# Altium project Signal_Processing_Board_Manta.PrjPcb (part 1 of 2)
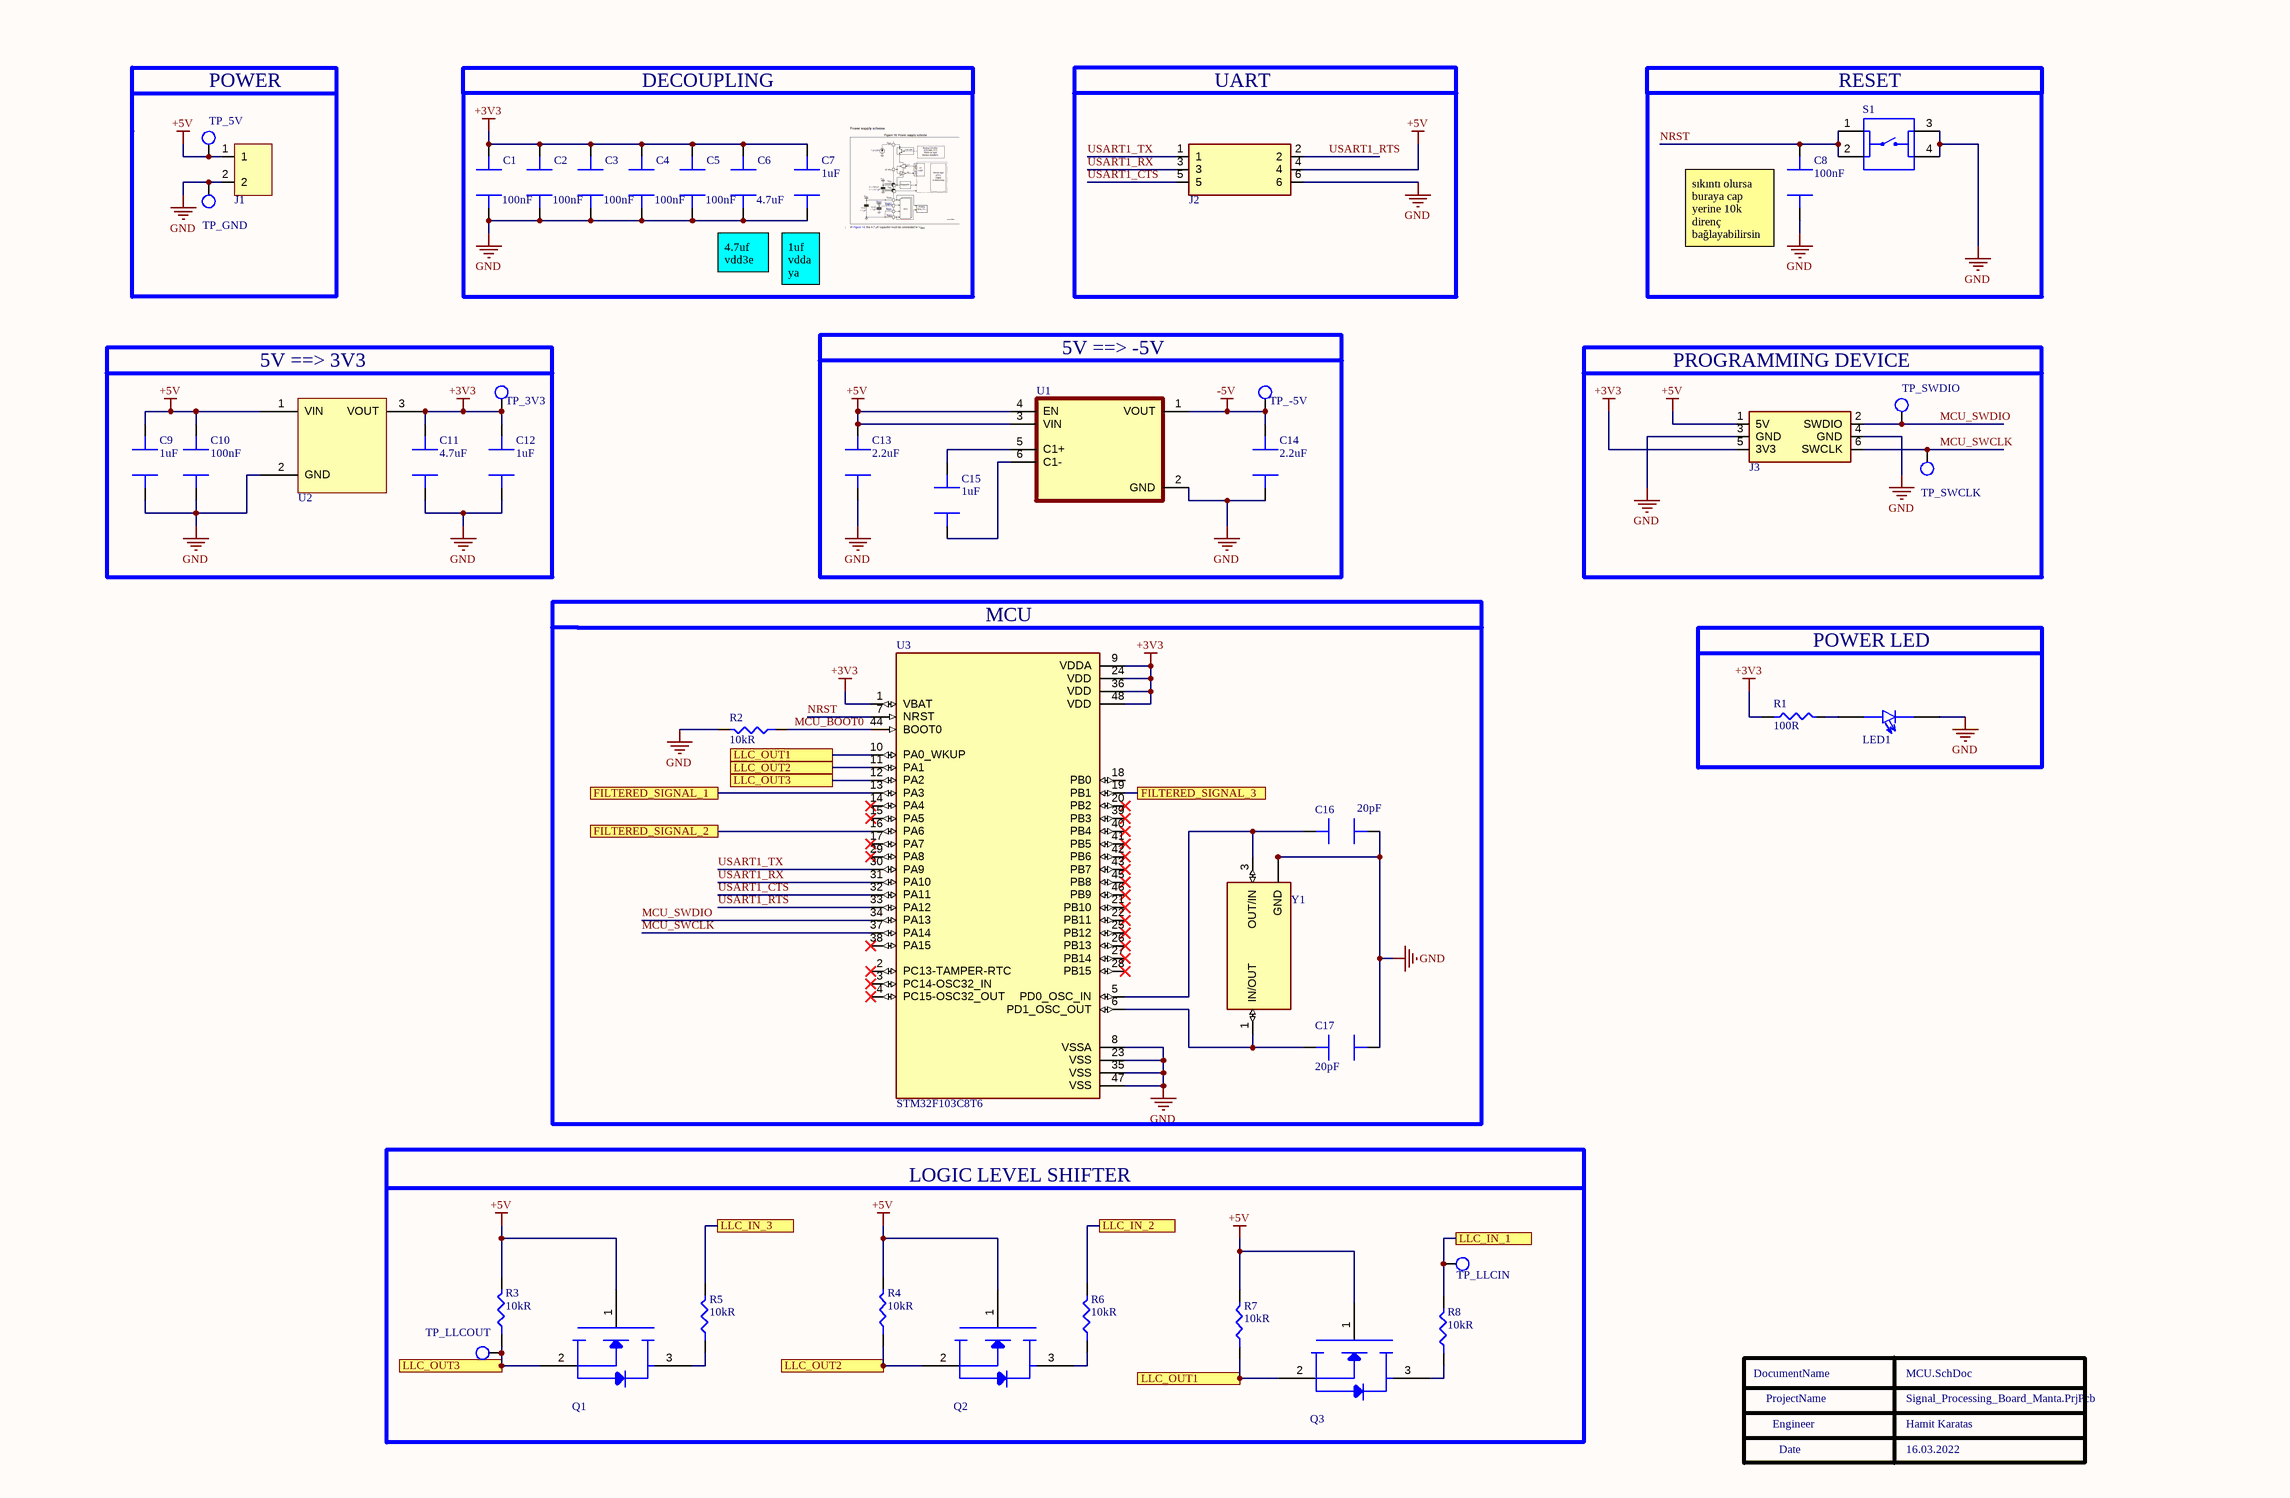
[diagram p0: MCU.SchDoc]
2 sheets, 122 parts. Net scope: flat (ports and power ports of the same name join across sheets).
Board file: MantaFilter.PcbDoc
Sheets:
  MCU.SchDoc
  FILTER.SchDoc

## Sheet MCU.SchDoc
size 420 x 297 mm; Engineer: Hamit Karatas; SheetNumber: 1; SheetTotal: 2

### Parts
C1  Capacitance: 100nF  [CAP_0603]  (hidden comment: CAP CER 100nF 0603)
C2  Capacitance: 100nF  [CAP_0603]  (hidden comment: CAP CER 100nF 0603)
C3  Capacitance: 100nF  [CAP_0603]  (hidden comment: CAP CER 100nF 0603)
C4  Capacitance: 100nF  [CAP_0603]  (hidden comment: CAP CER 100nF 0603)
C5  Capacitance: 100nF  [CAP_0603]  (hidden comment: CAP CER 100nF 0603)
C6  Capacitance: 4.7uF  [cap_0805]  (hidden comment: CL21A475KAQNNNE)
C7  Capacitance: 1uF  [cap_0805]  (hidden comment: CAP CER 1uF 0805)
C8  Capacitance: 100nF  [CAP_0603]  (hidden comment: CAP CER 100nF 0603)
C9  Capacitance: 1uF  [cap_0805]  (hidden comment: CAP CER 1uF 0805)
C10  Capacitance: 100nF  [cap_0805]  (hidden comment: CL21B104KBCNNNC)
C11  Capacitance: 4.7uF  [cap_0805]  (hidden comment: CL21A475KAQNNNE)
C12  Capacitance: 1uF  [cap_0805]  (hidden comment: CAP CER 1uF 0805)
C13  Capacitance: 2.2uF  [CAP_1206]  (hidden comment: CAP CER 2.2uF)
C14  Capacitance: 2.2uF  [CAP_1206]  (hidden comment: CAP CER 2.2uF)
C15  Capacitance: 1uF  [cap_0805]  (hidden comment: CAP CER 1uF 0805)
C16  Capacitance: 20pF  [CAP_0603]  (hidden comment: CL10C200JB8NNNC)
C17  Capacitance: 20pF  [CAP_0603]  (hidden comment: CL10C200JB8NNNC)
J1  TERMINAL BLOCK, PLUGGABLE, 5.08,  [TBP01R1-508-02BE]  (value not drawn)
J2  67997-206HLF  [CONN 6 PINS 2 ROWS]  (value not drawn)
J3  67997-206HLF  [CONN 6 PINS 2 ROWS]  (value not drawn)
LED1  LTST-C171GKT  [LED GREEN 0805]  (value not drawn)
Q1  MOSFET 2N7002W  [SOT-323]  (value not drawn)
Q2  MOSFET 2N7002W  [SOT-323]  (value not drawn)
Q3  MOSFET 2N7002W  [SOT-323]  (value not drawn)
R1  Resistance: 100R  [RES_0603]  (hidden comment: RC0603FR-7W100RL)
R2  Resistance: 10kR  [RES_0603]  (hidden comment: RES 10K OHM 0603)
R3  Resistance: 10kR  [RES_0603]  (hidden comment: RES 10K OHM 0603)
R4  Resistance: 10kR  [RES_0603]  (hidden comment: RES 10K OHM 0603)
R5  Resistance: 10kR  [RES_0603]  (hidden comment: RES 10K OHM 0603)
R6  Resistance: 10kR  [RES_0603]  (hidden comment: RES 10K OHM 0603)
R7  Resistance: 10kR  [RES_0603]  (hidden comment: RES 10K OHM 0603)
R8  Resistance: 10kR  [RES_0603]  (hidden comment: RES 10K OHM 0603)
S1  1825910-6  [button]  (value not drawn)
TP_3V3  TEST_POINT  [TEST POINT]  (value not drawn)  (no BOM)
TP_5V  TEST_POINT  [TEST POINT]  (value not drawn)  (no BOM)
TP_-5V  TEST_POINT  [TEST POINT]  (value not drawn)  (no BOM)
TP_GND  TEST_POINT  [TEST POINT]  (value not drawn)  (no BOM)
TP_LLCIN  TEST_POINT  [TEST POINT]  (value not drawn)  (no BOM)
TP_LLCOUT  TEST_POINT  [TEST POINT]  (value not drawn)  (no BOM)
TP_SWCLK  TEST_POINT  [TEST POINT]  (value not drawn)  (no BOM)
TP_SWDIO  TEST_POINT  [TEST POINT]  (value not drawn)  (no BOM)
U1  Voltage Regulator (5V -> -5V) LM2776DBVT  [SOT23-6]  (value not drawn)
U2  AP7361-33E-13  [AP7361-33E-13]  (value not drawn)
U3  STM32F103C8T6  [LQFP-48]
Y1  CRYSTAL 8MHZ  [CRYSTAL 8MHZ]  (value not drawn)

### Blocks framed on the sheet
POWER: J1 TP_5V TP_GND
DECOUPLING: C1-C7
UART: J2
RESET: C8 S1
5V ==> 3V3: C9-C12 TP_3V3 U2
PROGRAMMING DEVICE: J3 TP_SWCLK TP_SWDIO
POWER LED: LED1 R1
LOGIC LEVEL SHIFTER: Q1-Q3 R3-R8 TP_LLCIN TP_LLCOUT

### Ports
FILTERED_SIGNAL_1, FILTERED_SIGNAL_2, FILTERED_SIGNAL_3, LLC_IN_1, LLC_IN_2, LLC_IN_3, LLC_OUT1, LLC_OUT2, LLC_OUT3

### Nets
+3V3: C1.2 C2.2 C3.2 C4.2 C5.2 C6.2 C7.2 C11.2 C12.2 J3.5(3V3) R1.2 TP_3V3.1(TP) U2.3(VOUT) U3.1(VBAT) U3.9(VDDA) U3.24(VDD) U3.36(VDD) U3.48(VDD)
+5V: C9.2 C10.2 C13.2 J1.1 J2.4 J3.1(5V) Q1.1(G) Q2.1(G) Q3.1(G) R3.2 R4.2 R7.2 TP_5V.1(TP) U1.3(VIN) U1.4(EN) U2.1(VIN)
-5V: C14.2 TP_-5V.1(TP) U1.1(VOUT)
GND: C1.1 C2.1 C3.1 C4.1 C5.1 C6.1 C7.1 C8.1 C9.1 C10.1 C11.1 C12.1 C13.1 C14.1 C16.1 C17.1 J1.2 J2.6 J3.3(GND) J3.4(GND) LED1.C R2.2 S1.3 S1.4 TP_GND.1(TP) U1.2(GND) U2.2(GND) U3.8(VSSA) U3.23(VSS) U3.35(VSS) U3.47(VSS) Y1.2(GND) Y1.4(GND)
MCU_BOOT0: R2.1 U3.44(BOOT0)
MCU_SWCLK: J3.6(SWCLK) TP_SWCLK.1(TP) U3.37(PA14)
MCU_SWDIO: J3.2(SWDIO) TP_SWDIO.1(TP) U3.34(PA13)
NRST: C8.2 S1.1 S1.2 U3.7(NRST)
USART1_CTS: J2.5 U3.32(PA11)
USART1_RTS: J2.2 U3.33(PA12)
USART1_RX: J2.3 U3.31(PA10)
USART1_TX: J2.1 U3.30(PA9)
NetC15_1: C15.1 U1.6(C1-)
NetC15_2: C15.2 U1.5(C1+)
NetC16_2: C16.2 U3.5(PD0_OSC_IN) Y1.3(OUT/IN)
NetC17_2: C17.2 U3.6(PD1_OSC_OUT) Y1.1(IN/OUT)
NetLED1_A: LED1.A R1.1
NetQ1_2: Q1.2(S) R3.1 TP_LLCOUT.1(TP) U3.12(PA2) ; port LLC_OUT3
NetQ1_3: Q1.3(D) R5.1
NetQ2_2: Q2.2(S) R4.1 U3.11(PA1) ; port LLC_OUT2
NetQ2_3: Q2.3(D) R6.1
NetQ3_2: Q3.2(S) R7.1 U3.10(PA0_WKUP) ; port LLC_OUT1
NetQ3_3: Q3.3(D) R8.1
NetR5_2: R5.2 ; port LLC_IN_3
NetR6_2: R6.2 ; port LLC_IN_2
NetR8_2: R8.2 TP_LLCIN.1(TP) ; port LLC_IN_1
NetR10_2: U3.13(PA3) ; port FILTERED_SIGNAL_1
NetR26_2: U3.16(PA6) ; port FILTERED_SIGNAL_2
NetR42_2: U3.19(PB1) ; port FILTERED_SIGNAL_3

Not connected (* = marked no-connect by the designer): U3 2(PC13-TAMPER-RTC)* 3(PC14-OSC32_IN)* 4(PC15-OSC32_OUT)* 14(PA4)* 15(PA5)* 17(PA7)* 18(PB0) 20(PB2)* 21(PB10)* 22(PB11)* 25(PB12)* 26(PB13)* 27(PB14)* 28(PB15)* 29(PA8)* 38(PA15)* 39(PB3)* 40(PB4)* 41(PB5)* 42(PB6)* 43(PB7)* 45(PB8)* 46(PB9)*

### Notes on the sheet
- (near C8) sıkıntı olursa buraya cap yerine 10k direnç bağlayabilirsin
- 4.7uf vdd3e
- (near C7) 1uf vdda ya
- power supply scheme
- 5V ==> -5V
- (near U3) MCU
- 1/4ts male (6.23mm)lik  girişten gelen sinyal filtrelere aktarılıyor. her entegrede 2 opamp var ama her 3 opamp için 2 entegre kullanılacak (2*3=6). Sinyaller hem logic level shifterdan hem de filtrelerden adclere gidecek. Dijitale dönüştürülüp jetsona yollanacak veya burada fast fourier transform yapılıp kontrol kartına motor komutu gönderecek.
- DocumentName
- Çıkışlar mikrodenetleyicinin adc'sine bağlanacak. Bu yüzden çıkışların 2.4V-3.3V aralığında olması gerekiyor. Ltspice'da 5v verince 3v3'e yakın bir değer elde edildiği için 5v bağlandı. sorun olması durumunda 3v3 bağlantısı yapılmalı
- ProjectName
- Engineer
- Date
- 16.03.2022
- THIS DOCUMENT AND THE DATA DISCLOSED HEREIN OR
- HEREWITH IS THE PROPERTY OF ALTIUM LIMITED AND MAY
- DWG NO:
- REVISION
- REV:
- DESCRIPTION
- DATE
- APPROVED
- BE FREELY DISTRIBUTED IN WHOLE. NO RIGHTS ARE
- RESERVED OR EXPRESS OR IMPLIED WARANTEE GIVEN.
- ENG:
- APPROVALS
- PROJECT
- DSN:
- CHK:
- REFERENCE DOCUMENTS
- PROJECT REVISION:
- TITLE
- DOCUMENT REVISION:
- DESIGN ITEM:
- BOM:
- FAB DWG:
- PCB DWG:
- ASSY DWG:
- SCALE:
- A3
- SIZE
- CAGE CODE
- FILE NAME
- DWG NO.
- SHEET
- OF
- REV
- 31.01.2022
- 31.01.2000

### Library data of the parts
C1-C5 C8 = CAP CER 100nF 0603: KEMET - C0603C104K5RACTU - SMD Multilayer Ceramic Capacitor, 0.1 µF, 50 V, 0603 [1608 Metric], ± 10%, X7R, C Series KEMET; Designed by: Hamit; Voltage Rating (DC): 50V; Dissipation Factor: 2.5%; Supplier 1: Digi-Key; Manufacturer: KEMET; Manufacturer Part Number: C0603C104K5RACTU; RoHS: Yes; Category: Ceramic Capacitors; Stock 1: 4486940; Pricing 1: 1=0,12000, 10=0,08900, 50=0,04840, 100=0,03940, 500=0,02818, 1000=0,02214 (USD); Mount: Surface Mount; Case/Package: 0603; Number of Pins: 2; Case Code (Metric): 1608; Case Code (Imperial): 0603; Dielectric Material: Ceramic; Contact Plating: Tin,Matte; Min Operating Temperature: -55°C; Max Operating Temperature: 125°C; Tolerance: 10%; Packaging: Tape and Reel; Package Quantity: 1; Dielectric: X7R; Termination: SMD/SMT; Voltage: 50V; Voltage Rating: 50V; Series: SMD Comm X7R; Length: 0.063inch; Width: 0.031inch; Height: 0.8mm; Thickness: 0.034inch; Lead Pitch: 0.7mm; Depth: 0.8mm; Radiation Hardening: No; RoHS Compliant: Yes; REACH SVHC: No SVHC; ComponentLink1URL: https://datasheet.ciiva.com/7823/kem-c1002-x7r-smd-7823591.pdf?src-supplier=Element14; ComponentLink1Description: https://datasheet.ciiva.com/7823/kem-c1002-x7r-smd-7823591.pdf?src-supplier=Element14; ComponentLink2URL: https://datasheet.ciiva.com/14602/70095383-14602583.pdf?src-supplier=Allied+Electronics; ComponentLink2Description: https://datasheet.ciiva.com/14602/70095383-14602583.pdf?src-supplier=Allied+Electronics; ComponentLink3URL: https://datasheet.ciiva.com/5999/kem-c1002-x7r-smd-5999400.pdf?src-supplier=Farnell; ComponentLink3Description: https://datasheet.ciiva.com/5999/kem-c1002-x7r-smd-5999400.pdf?src-supplier=Farnell; ComponentLink4URL: https://datasheet.ciiva.com/7823/kem-c1002-x7r-smd-7823592.pdf?src-supplier=Element14; ComponentLink4Description: https://datasheet.ciiva.com/7823/kem-c1002-x7r-smd-7823592.pdf?src-supplier=Element14; ComponentLink5URL: https://datasheet.ciiva.com/28645/1851736-28645640.pdf?src-supplier=Element14; ComponentLink5Description: https://datasheet.ciiva.com/28645/1851736-28645640.pdf?src-supplier=Element14; ComponentLink6URL: https://datasheet.ciiva.com/14585/70095383-14585209.pdf?src-supplier=Allied+Electronics; ComponentLink6Description: https://datasheet.ciiva.com/14585/70095383-14585209.pdf?src-supplier=Allied+Electronics; Supplier Part Number 1: 399-5089-6-ND
C6 = CAP CER 4.7 uF: SAMSUNG ELECTRO-MECHANICS - CL21A475KAQNNNE - SMD Multilayer Ceramic Capacitor, 4.7 µF, 25 V, 0805 [2012 Metric], ± 10%, X5R, CL Series; Voltage Rating: 25V; Designed by: Hamit; Supplier 1: Digi-Key; Manufacturer: Samsung; Manufacturer Part Number: CL21A475KAQNNNE; RoHS: Yes; Category: Ceramic Capacitors; Pricing 1: 1=0,12000, 10=0,08300, 50=0,04700, 100=0,03890, 500=0,02728, 1000=0,02259 (USD); Mount: Surface Mount; Case/Package: 0805; Case Code (Metric): 2012; Case Code (Imperial): 0805; Min Operating Temperature: -55°C; Max Operating Temperature: 85°C; Package Quantity: 1; Packaging: Tape and Reel; Tolerance: 10%; Dielectric: X5R; Voltage Rating (DC): 25V; Series: CL; Construction: Flat; Length: 2mm; Width: 0.049inch; Height: 1.25mm; Thickness: 0.055inch; Depth: 1.25mm; Radiation Hardening: No; Lead Free: Lead Free; RoHS Compliant: Yes; ComponentLink1URL: https://datasheet.ciiva.com/25798/cl21a475kaqnnne-25798882.pdf?src-supplier=Digi-Key; ComponentLink1Description: https://datasheet.ciiva.com/25798/cl21a475kaqnnne-25798882.pdf?src-supplier=Digi-Key; Supplier Part Number 1: 1276-1244-1-ND
C7 C9 C12 C15 = CAP CER 1uF 0805: 0805 0.1 uF ±10 % Tolerance 50 V X7R Multilayer Ceramic Capacitors; Manufacturer: Samsung; Manufacturer Part Number: CL21B104KBFNNNE; Designed by: Hamit; Tolerance: 10%; Voltage Rating: 50V; Supplier 1: Digi-Key; RoHS: Yes; Category: Ceramic Capacitors; Pricing 1: 1=0,10000, 10=0,04900, 50=0,02700, 100=0,02200, 500=0,01574, 1000=0,01237 (USD); Mount: Surface Mount; Case/Package: 0805; Case Code (Metric): 2012; Case Code (Imperial): 0805; Contact Plating: Tin; Min Operating Temperature: -55°C; Max Operating Temperature: 125°C; Dielectric: X7R; Package Quantity: 1; Packaging: Tape and Reel; Voltage Rating (DC): 50V; Series: CL; Construction: Flat; Length: 2mm; Width: 0.049inch; Height: 1.25mm; Thickness: 0.053inch; Depth: 1.25mm; Radiation Hardening: No; Lead Free: Lead Free; RoHS Compliant: Yes; ComponentLink1URL: https://datasheet.ciiva.com/25736/cl21b104kbfnnne-25736721.pdf?src-supplier=Digi-Key; ComponentLink1Description: https://datasheet.ciiva.com/25736/cl21b104kbfnnne-25736721.pdf?src-supplier=Digi-Key; Supplier Part Number 1: 1276-1180-1-ND
C10 = CAP cer 100nF 0805: Samsung Electro-Mechanics 100nF Multilayer Ceramic Capacitor (MLCC) 50 V 10% X7R dielectric CL max op. temp. +125C; Designed by: Hamit; Voltage Rating: 50V; Supplier 1: Digi-Key; Manufacturer: Samsung; Manufacturer Part Number: CL21B104KBCNNNC; RoHS: Yes; Category: Ceramic Capacitors; Pricing 1: 1=0,10000, 10=0,05000, 50=0,02740, 100=0,02240, 500=0,01598, 1000=0,01256 (USD); Mount: Surface Mount; Case/Package: 0805; Case Code (Metric): 2012; Case Code (Imperial): 0805; Material: Ceramic; Contact Plating: Tin; Min Operating Temperature: -55°C; Max Operating Temperature: 125°C; Tolerance: 10%; Dielectric: X7R; Packaging: Tape and Reel; Voltage: 50V; Voltage Rating (DC): 50V; Series: CL; Construction: Flat; Length: 2mm; Width: 0.049inch; Height: 0.85mm; Depth: 1.25mm; Thickness: 0.037inch; Radiation Hardening: No; Lead Free: Lead Free; RoHS Compliant: Yes; ComponentLink1URL: https://datasheet.ciiva.com/25710/cl21b104kbcnnnc-25710182.pdf?src-supplier=Digi-Key; ComponentLink1Description: https://datasheet.ciiva.com/25710/cl21b104kbcnnnc-25710182.pdf?src-supplier=Digi-Key; ComponentLink2URL: https://datasheet.ciiva.com/29199/454152-da-01-en-vs-kondensator-0805-29199814.pdf?src-supplier=Conrad; ComponentLink2Description: https://datasheet.ciiva.com/29199/454152-da-01-en-vs-kondensator-0805-29199814.pdf?src-supplier=Conrad; Supplier Part Number 1: 1276-1003-1-ND
C11 = CAP_0805_4.7uF: SAMSUNG ELECTRO-MECHANICS - CL21A475KAQNNNE - SMD Multilayer Ceramic Capacitor, 4.7 µF, 25 V, 0805 [2012 Metric], ± 10%, X5R, CL Series; Voltage Rating: 25V; Designed by: Hamit; Supplier 1: Mouser; Manufacturer: Samsung; Manufacturer Part Number: CL21A475KAQNNNE; RoHS: Yes; Category: Ceramic Capacitors; Stock 1: 975; Pricing 1: 1=0,12000, 10=0,04800, 50=0,04800, 100=0,03900, 500=0,02800, 1000=0,02300, 2000=0,02000, 10000=0,02000 (USD); Mount: Surface Mount; Case/Package: 0805; Case Code (Metric): 2012; Case Code (Imperial): 0805; Min Operating Temperature: -55°C; Max Operating Temperature: 85°C; Package Quantity: 1; Packaging: Tape and Reel; Tolerance: 10%; Dielectric: X5R; Voltage Rating (DC): 25V; Series: CL; Construction: Flat; Length: 2mm; Width: 0.049inch; Height: 1.25mm; Thickness: 0.055inch; Depth: 1.25mm; Radiation Hardening: No; Lead Free: Lead Free; RoHS Compliant: Yes; ComponentLink1URL: https://datasheet.ciiva.com/25798/cl21a475kaqnnne-25798882.pdf?src-supplier=Digi-Key; ComponentLink1Description: https://datasheet.ciiva.com/25798/cl21a475kaqnnne-25798882.pdf?src-supplier=Digi-Key; Supplier Part Number 1: 187-CL21A475KAQNNNE
C13 C14 = CAP CER 2.2uF: Cap Ceramic 2.2uF 16V X7R 10% SMD 1206 125°C Plastic T/R; Manufacturer: KEMET; Manufacturer Part Number: C1206C225K4RACTU; Dissipation Factor: 5%; Supplier 1: Digi-Key; RoHS: Yes; Category: Ceramic Capacitors; Stock 1: 42974; Pricing 1: 1=0,36000, 10=0,24800, 50=0,16500, 100=0,14020, 500=0,09900, 1000=0,08662 (USD); Mount: Surface Mount,PCB; Case/Package: 1206; Case Code (Imperial): 1206; Case Code (Metric): 3216; Dielectric Material: Ceramic; Min Operating Temperature: -55°C; Max Operating Temperature: 125°C; Tolerance: 10%; Voltage Rating: 16V; Voltage Rating (DC): 16V; Packaging: Tape and Reel; Package Quantity: 1; Termination: SMD/SMT; Voltage: 16V; Dielectric: X7R; Series: C; Construction: Flat; Length: 3.2mm; Width: 1.6mm; Height: 1mm; Depth: 1.6mm; Thickness: 0.071inch; Radiation Hardening: No; REACH SVHC: No SVHC; RoHS Compliant: Yes; ComponentLink1URL: https://datasheet.ciiva.com/39122/docfinderpartnumberc0402c102k5ractu-39122950.pdf?src-supplier=Onlinecomponents.com; ComponentLink1Description: https://datasheet.ciiva.com/39122/docfinderpartnumberc0402c102k5ractu-39122950.pdf?src-supplier=Onlinecomponents.com; ComponentLink2URL: https://datasheet.ciiva.com/14609/70095383-14609275.pdf?src-supplier=Allied+Electronics; ComponentLink2Description: https://datasheet.ciiva.com/14609/70095383-14609275.pdf?src-supplier=Allied+Electronics; ComponentLink3URL: https://datasheet.ciiva.com/28688/1851736-28688683.pdf?src-supplier=Element14; ComponentLink3Description: https://datasheet.ciiva.com/28688/1851736-28688683.pdf?src-supplier=Element14; ComponentLink4URL: https://datasheet.ciiva.com/7730/kem-c1002-x7r-smd-7730124.pdf?src-supplier=Element14; ComponentLink4Description: https://datasheet.ciiva.com/7730/kem-c1002-x7r-smd-7730124.pdf?src-supplier=Element14; ComponentLink5URL: https://datasheet.ciiva.com/5969/kem-c1002-x7r-smd-5969822.pdf?src-supplier=Farnell; ComponentLink5Description: https://datasheet.ciiva.com/5969/kem-c1002-x7r-smd-5969822.pdf?src-supplier=Farnell; Supplier Part Number 1: 399-C1206C225K4RAC7800DKR-ND
C16 C17 = CAP CER 20PF: SAMSUNG ELECTRO-MECHANICS - CL10C200JB8NNNC - SMD Multilayer Ceramic Capacitor, 20 pF, 50 V, 0603 [1608 Metric], ± 5%, C0G / NP0, CL Series; Voltage Rating: 50V; Temperature Coefficient: 300ppm/°C; Designed by: Hamit; Supplier 1: Digi-Key; Manufacturer: Samsung; Manufacturer Part Number: CL10C200JB8NNNC; RoHS: Yes; Category: Ceramic Capacitors; Stock 1: 540004; Pricing 1: 1=0,10000, 10=0,04900, 50=0,02680, 100=0,02180, 500=0,01558, 1000=0,01224 (USD); Mount: Surface Mount; Case/Package: 0603; Case Code (Metric): 1608; Case Code (Imperial): 0603; Min Operating Temperature: -55°C; Max Operating Temperature: 125°C; Tolerance: 5%; Dielectric: C0G; Package Quantity: 1; Packaging: Tape and Reel; Voltage: 50V; Series: CL; Construction: Flat; Length: 1.6mm; Width: 0.031inch; Height: 0.8mm; Thickness: 0.035inch; Depth: 0.8mm; Radiation Hardening: No; RoHS Compliant: Yes; ComponentLink1URL: https://datasheet.ciiva.com/26877/getdatasheetpartid-640634-26877974.pdf?src-supplier=Verical; ComponentLink1Description: https://datasheet.ciiva.com/26877/getdatasheetpartid-640634-26877974.pdf?src-supplier=Verical; ComponentLink2URL: https://datasheet.ciiva.com/26310/mlcc-catalogdownload2013-eng-26310315.pdf?src-supplier=Distrelec; ComponentLink2Description: https://datasheet.ciiva.com/26310/mlcc-catalogdownload2013-eng-26310315.pdf?src-supplier=Distrelec; Supplier Part Number 1: 1276-1187-1-ND
J1 = TERMINAL BLOCK TBP01R1-508-02BE: Conn Shrouded Header HDR 2 POS 5.08mm Solder RA Side Entry Thru-Hole Bag; Manufacturer: CUI; Designed by: Hamit; Supplier 1: Digi-Key; Manufacturer Part Number: TBP01R1-508-02BE; RoHS: Yes; Stock 1: 4344; Pricing 1: 1=0,56000, 10=0,29600, 25=0,20960, 50=0,17840, 100=0,17220, 250=0,14560, 500=0,13464, 1000=0,11898, 5000=0,09080 (USD); Supplier Part Number 1: 102-6406-ND
J2 J3 = CONN 6 PIN 2 ROWS: Conn Unshrouded Header HDR 6 POS 2.54mm Solder ST Top Entry Thru-Hole BergStik® Bulk; Manufacturer: ICC; Supplier 1: Newark; Manufacturer Part Number: 67997-206HLF; RoHS: No; Category: Headers and Wire Housings; Stock 1: 424; Pricing 1: 1=0,46900, 10=0,32500, 25=0,32100, 50=0,31700, 100=0,31300, 250=0,29200, 500=0,27200, 1000=0,23100, 2500=0,16100, 5000=0,15200, 10000=0,13400 (USD); Supplier Part Number 1: 33M7873
LED1 = LED GREEN 0805: Green 0805 130 º Min 5 mcd Typical 12 mcd Water Clear Lens SMT LED; Manufacturer: Vishay Lite-On; Designed by: Hamit; Lens Color: Colorless; Viewing Angle: 130°; Lens Style: Diffused,Colorless,Rectangular,Clear; Luminous Intensity: 12mcd; Forward Current: 30mA; Forward Voltage: 2.1V; Power Rating: 100mW; Dominant Wavelength: 569nm; Test Current: 10mA; Number of Elements: 1; Wavelength: 585nm; Reverse Voltage: 5V; Supplier 1: Digi-Key; Manufacturer Part Number: LTST-C171GKT; RoHS: Yes; Category: LEDs; Pricing 1: 6000=0,00000 (USD); Mount: Surface Mount; Case/Package: 0805; Number of Pins: 2; Color: Green; Case Code (Metric): 2012; Case Code (Imperial): 0805; Min Operating Temperature: -55°C; Max Operating Temperature: 85°C; Package Quantity: 1; Packaging: Tape and Reel; Illumination Color: Green; Lens Transparency: Clear; Power Dissipation: 100mW; Number of LEDs: 1; Series: CHIPLED 0805; Length: 2mm; Width: 1.25mm; Height: 0.8mm; Depth: 1.25mm; Radiation Hardening: No; Lead Free: Lead Free; RoHS Compliant: Yes; ComponentLink1URL: https://datasheet.ciiva.com/2110/ltst-c171gkt-2110000.pdf?src-supplier=Digi-Key; ComponentLink1Description: https://datasheet.ciiva.com/2110/ltst-c171gkt-2110000.pdf?src-supplier=Digi-Key; ComponentLink2URL: https://datasheet.ciiva.com/11773/0900766b80dc0296-11773991.pdf?src-supplier=RSComponents; ComponentLink2Description: https://datasheet.ciiva.com/11773/0900766b80dc0296-11773991.pdf?src-supplier=RSComponents; ComponentLink3URL: https://datasheet.ciiva.com/12400/lite-on-ltst-c171gkt-190133-12400647.pdf?src-supplier=Mouser; ComponentLink3Description: https://datasheet.ciiva.com/12400/lite-on-ltst-c171gkt-190133-12400647.pdf?src-supplier=Mouser; ComponentLink4URL: https://datasheet.ciiva.com/2110/ltst-c171gkt-2110001.pdf?src-supplier=Digi-Key; ComponentLink4Description: https://datasheet.ciiva.com/2110/ltst-c171gkt-2110001.pdf?src-supplier=Digi-Key; ComponentLink5URL: https://datasheet.ciiva.com/2110/ltst-c171gkt-2110002.pdf?src-supplier=Digi-Key; ComponentLink5Description: https://datasheet.ciiva.com/2110/ltst-c171gkt-2110002.pdf?src-supplier=Digi-Key; ComponentLink6URL: https://datasheet.ciiva.com/16396/ltst-c171gkt-16396549.pdf?src-supplier=Future+Electronics; ComponentLink6Description: https://datasheet.ciiva.com/16396/ltst-c171gkt-16396549.pdf?src-supplier=Future+Electronics; Supplier Part Number 1: 160-1423-2-ND
Q1-Q3 = MOSFET 2N7002W: MOSFETs (Field Effect Transistor), SOT-323, 60V, 0.115A, N, 0.200W; Manufacturer: ON Semiconductor / Fairchild; Continuous Drain Current (ID): 115mA; Gate to Source Voltage (Vgs): 20V; Turn-Off Delay Time: 12.5ns; Rds On Max: 7.5R; Input Capacitance: 50pF; Max Power Dissipation: 200mW; Turn-On Delay Time: 5.85ns; Element Configuration: Single; Polarity: N-CHANNEL; Number of Elements: 1; Threshold Voltage: 1.76V; Supplier 1: Future Electronics; Manufacturer Part Number: 2N7002W; RoHS: Yes; Category: MOSFETs; Stock 1: 87000; Pricing 1: 3000=0,09500, 6000=0,07760, 9000=0,07690, 12000=0,07640, 15000=0,07600 (USD); Mount: Surface Mount; Case/Package: SOT-323; Number of Pins: 3; Contact Plating: Tin,Matte; Weight: 0.03g; Min Operating Temperature: -55°C; Max Operating Temperature: 150°C; Packaging: Tape and Reel; Package Quantity: 1; Drain to Source Resistance: 7.5R; Power Dissipation: 200mW; Drain to Source Breakdown Voltage: 60V; Drain to Source Voltage (Vdss): 60V; On-State Resistance: 7.5R; Drain-source On Resistance-Max: 7.5R; Length: 2mm; Width: 1.25mm; Height: 1mm; Radiation Hardening: No; RoHS Compliant: Yes; Lead Free: Lead Free; REACH SVHC: No SVHC; ComponentLink1URL: https://datasheet.ciiva.com/16822/2n7002w-16822449.pdf?src-supplier=Future+Electronics; ComponentLink1Description: https://datasheet.ciiva.com/16822/2n7002w-16822449.pdf?src-supplier=Future+Electronics; ComponentLink2URL: https://datasheet.ciiva.com/4439/2n7002w-101039-4439142.pdf?src-supplier=Mouser; ComponentLink2Description: https://datasheet.ciiva.com/4439/2n7002w-101039-4439142.pdf?src-supplier=Mouser; ComponentLink3URL: https://datasheet.ciiva.com/931/2n7002w-931803.pdf?src-supplier=Digi-Key; ComponentLink3Description: https://datasheet.ciiva.com/931/2n7002w-931803.pdf?src-supplier=Digi-Key; ComponentLink4URL: https://datasheet.ciiva.com/931/2n7002w-931805.pdf?src-supplier=Digi-Key; ComponentLink4Description: https://datasheet.ciiva.com/931/2n7002w-931805.pdf?src-supplier=Digi-Key; ComponentLink5URL: https://datasheet.ciiva.com/931/2n7002w-931804.pdf?src-supplier=Digi-Key; ComponentLink5Description: https://datasheet.ciiva.com/931/2n7002w-931804.pdf?src-supplier=Digi-Key; Supplier Part Number 1: 5893953
R1 = RES 100 OHM 0603: RESISTOR, 0603, 100R, 1%; Manufacturer: Yageo; Voltage Rating: 50V; Power Rating: 100mW; Temperature Coefficient: 100ppm/°C; Supplier 1: Digi-Key; Manufacturer Part Number: RC0603FR-7W100RL; RoHS: Yes; Category: Chip SMD Resistors; Stock 1: 23140; Pricing 1: 1=0,10000, 10=0,03600, 100=0,01450, 1000=0,00652, 2500=0,00566 (USD); Case/Package: 0603; Number of Pins: 2; Case Code (Metric): 1608; Case Code (Imperial): 0603; Packaging: Cut Tape; Tolerance: 1%; Resistor Type: Thick Film; Voltage Rating (DC): 50V; Resistance Tolerance: 1%; Series: RC0603; REACH SVHC: Unknown; RoHS Compliant: Yes; ComponentLink1URL: https://datasheet.ciiva.com/22704/1675737-22704044.pdf?src-supplier=Element14; ComponentLink1Description: https://datasheet.ciiva.com/22704/1675737-22704044.pdf?src-supplier=Element14; ComponentLink2URL: https://datasheet.ciiva.com/7746/1675737-7746414.pdf?src-supplier=Element14; ComponentLink2Description: https://datasheet.ciiva.com/7746/1675737-7746414.pdf?src-supplier=Element14; Supplier Part Number 1: 13-RC0603FR-7W100RLCT-ND
R2-R8 = RES 10K OHM 0603: Res General Purpose Thick Film 0603 10K Ohm 1% 1/10W ±100ppm/°C Molded SMD Paper T/R; Manufacturer: Yageo; Manufacturer Part Number: RC0603FR-0710KL; Voltage Rating (DC): 50V; Power Rating: 100mW; Voltage Rating: 75V; Designed by: Hamit; Supplier 1: Digi-Key; RoHS: Yes; Category: Chip SMD Resistors; Stock 1: 28304153; Pricing 1: 1=0,10000, 10=0,02400, 100=0,00970, 1000=0,00436, 2500=0,00378 (USD); Case/Package: 0603; Number of Pins: 2; Case Code (Imperial): 0603; Case Code (Metric): 1608; Weight: 7.1E-05oz; Size Code: 0603; Min Operating Temperature: -55°C; Max Operating Temperature: 155°C; Tolerance: 1%; Resistor Type: Thick Film; Temperature Coefficient: 100ppm/°C; Packaging: Tape and Reel; Termination: SMD/SMT; Features: Moisture Resistant; Series: RC; Max Power Dissipation: 100mW; Number of Terminations: 2; Resistance Tolerance: 1%; Construction: Rectangular; Length: 1.6mm; Width: 0.8mm; Height: 0.45mm; Depth: 0.8mm; Lead Pitch: 0.3mm; REACH SVHC: Unknown; Lead Free: Lead Free; Military Standard: Not; RoHS Compliant: Yes; ComponentLink1URL: https://datasheet.ciiva.com/7660/38590-7660789.pdf?src-supplier=Element14; ComponentLink1Description: https://datasheet.ciiva.com/7660/38590-7660789.pdf?src-supplier=Element14; ComponentLink2URL: https://datasheet.ciiva.com/7983/443971-7983596.pdf?src-supplier=Element14; ComponentLink2Description: https://datasheet.ciiva.com/7983/443971-7983596.pdf?src-supplier=Element14; ComponentLink3URL: https://datasheet.ciiva.com/22747/443971-22747519.pdf?src-supplier=Element14; ComponentLink3Description: https://datasheet.ciiva.com/22747/443971-22747519.pdf?src-supplier=Element14; ComponentLink4URL: https://datasheet.ciiva.com/46440/1868787-46440891.pdf?src-supplier=Element14; ComponentLink4Description: https://datasheet.ciiva.com/46440/1868787-46440891.pdf?src-supplier=Element14; ComponentLink5URL: https://datasheet.ciiva.com/7746/1738695-7746239.pdf?src-supplier=Element14; ComponentLink5Description: https://datasheet.ciiva.com/7746/1738695-7746239.pdf?src-supplier=Element14; ComponentLink6URL: https://datasheet.ciiva.com/15189/getdatasheetpartid-409289-15189591.pdf?src-supplier=Verical; ComponentLink6Description: https://datasheet.ciiva.com/15189/getdatasheetpartid-409289-15189591.pdf?src-supplier=Verical; Supplier Part Number 1: 311-10.0KHRCT-ND
S1 = button 4 pads: Switch Tactile OFF (ON) SPST Round Button PC Pins 0.05A 24VDC 1.57N Thru-Hole Loose; Manufacturer: TE Connectivity Alcoswitch; Mechanical Life: 100000Cycles; Actuator Material: PBT; Actuator Color: Black; Operating Force: 160gf; Illumination Type: Non-Illuminated,Illuminated; Switch Travel: 0.25mm; Switch Function: Off-Mom; Max Voltage Rating (DC): 24V; Contact Current Rating: 50mA; Actuator Type: Standard; Contact Resistance: 100mR; Actuator Length: 0.055inch; Supplier 1: Digi-Key; Manufacturer Part Number: 1825910-6; RoHS: Yes; Category: Pushbutton Switches; Stock 1: 136328; Pricing 1: 1=0,12000, 10=0,11300, 25=0,10720, 100=0,09750, 250=0,09164, 500=0,08382, 1000=0,07018, 2500=0,06823, 5000=0,06433 (USD); Mount: Through Hole; Contact Material: Copper Alloy; Contact Plating: Silver; Min Operating Temperature: -35°C; Max Operating Temperature: 85°C; Termination: PC Pins; Throw Configuration: SPST; Package Quantity: 750; Packaging: Loose Piece; Orientation: Straight; Series: FSMJ; Electrical Life: 100000Cycles; Type: Switch; Max Current Rating: 50mA; Length: 5.99mm; RoHS Compliant: Yes; REACH SVHC: Unknown; ELV: Compliant; Lead Free: Lead Free; ComponentLink1URL: https://datasheet.ciiva.com/30199/1825910-6rqpn1825910-6-30199520.pdf?src-supplier=Onlinecomponents.com; ComponentLink1Description: https://datasheet.ciiva.com/30199/1825910-6rqpn1825910-6-30199520.pdf?src-supplier=Onlinecomponents.com; ComponentLink2URL: https://datasheet.ciiva.com/15184/getdatasheetpartid-395915-15184509.pdf?src-supplier=Verical; ComponentLink2Description: https://datasheet.ciiva.com/15184/getdatasheetpartid-395915-15184509.pdf?src-supplier=Verical; Supplier Part Number 1: 450-1650-ND
TP_3V3 TP_5V TP_-5V TP_GND TP_LLCIN TP_LLCOUT TP_SWCLK TP_SWDIO = TEST POINT
U1 = Voltage Regulator (5V -> -5V) LM2776DBVT: Charge Pump INV -2.7V to -5.5V 200mA 6-Pin SOT-23 T/R; Manufacturer: Texas Instruments; Number of Outputs: 1; Min Input Voltage: 2.7V; Max Input Voltage: 5.5V; Switching Frequency: 2MHz; Synchronous Rectifier: No; Quiescent Current: 100uA; Output Type: Fixed,Adjustable; Output Configuration: Negative; Supplier 1: Digi-Key; Manufacturer Part Number: LM2776DBVT; RoHS: Yes; Category: Voltage Regulators - Switching; Stock 1: 9872; Pricing 1: 1=1,37000, 10=1,22300, 25=1,16040, 100=0,95330 (USD); Mount: Surface Mount; Case/Package: SOT-23-6; Number of Pins: 6; Min Operating Temperature: -40°C; Max Operating Temperature: 85°C; Packaging: Tape and Reel; Output Current: 200mA; Min Output Voltage: -5.5V; Max Output Voltage: -2.7V; Output Voltage: -5.5V; Topology: Charge Pump; REACH SVHC: No SVHC; Lead Free: Lead Free; RoHS Compliant: Yes; ComponentLink1URL: http://www.ti.com/general/docs/lit/getliterature.tsp?genericPartNumber=LM2776&amp;&amp;fileType=pdf&src-supplier=Farnell; ComponentLink1Description: http://www.ti.com/general/docs/lit/getliterature.tsp?genericPartNumber=LM2776&amp;&amp;fileType=pdf&src-supplier=Farnell; ComponentLink2URL: http://www.ti.com/general/docs/lit/getliterature.tsp?genericPartNumber=LM2776&&fileType=pdf&src-supplier=Element14; ComponentLink2Description: http://www.ti.com/general/docs/lit/getliterature.tsp?genericPartNumber=LM2776&&fileType=pdf&src-supplier=Element14; ComponentLink3URL: http://www.ti.com/lit/ds/symlink/lm2776.pdf?src-supplier=Digi-Key; ComponentLink3Description: http://www.ti.com/lit/ds/symlink/lm2776.pdf?src-supplier=Digi-Key; ComponentLink4URL: http://www.ti.com/general/docs/suppproductinfo.tsp?distId=10&amp;gotoUrl=http%3A%2F%2Fwww.ti.com%2Flit%2Fgpn%2Flm2776&src-supplier=Digi-Key; ComponentLink4Description: http://www.ti.com/general/docs/suppproductinfo.tsp?distId=10&amp;gotoUrl=http%3A%2F%2Fwww.ti.com%2Flit%2Fgpn%2Flm2776&src-supplier=Digi-Key; Supplier Part Number 1: 296-42300-1-ND
U2 = REGULATOR AP7361-33E-13: LDO Regulator Pos 3.3V 1A 4-Pin(3+Tab) SOT-223 T/R; Manufacturer: Diodes; Designed by: Hamit; Number of Outputs: 1; Min Input Voltage: 2.2V; Max Input Voltage: 6V; Max Power Dissipation: 1.1W; Dropout Voltage: 500mV; Min Current Limit: 1.1A; Polarity: Positive; Quiescent Current: 70uA; Power Dissipation: 1.1kW; Accuracy: 1%; Power Supply Rejection Ratio (PSRR): 65dB; Reference Voltage: 800mV; Output Type: Fixed; Supplier 1: Digi-Key; Manufacturer Part Number: AP7361-33E-13; RoHS: Yes; Category: Voltage Regulators - Linear; Pricing 1: 1=0,51000, 10=0,41400, 25=0,37840, 100=0,28150, 250=0,25516, 500=0,21116, 1000=0,15836 (USD); Mount: Surface Mount; Case/Package: SOT-223; Number of Pins: 4; Weight: 0.000282oz; Contact Plating: Tin,Matte; Min Operating Temperature: -40°C; Max Operating Temperature: 85°C; Max Output Current: 1A; Output Voltage: 3.3V; Package Quantity: 1; Packaging: Tape and Reel; Output Current: 1A; Number of Regulators: 1; Series: -; Radiation Hardening: No; REACH SVHC: No SVHC; Lead Free: Lead Free; RoHS Compliant: Yes; ComponentLink1URL: https://datasheet.ciiva.com/26926/getdatasheetpartid-670786-26926141.pdf?src-supplier=Verical; ComponentLink1Description: https://datasheet.ciiva.com/26926/getdatasheetpartid-670786-26926141.pdf?src-supplier=Verical; ComponentLink2URL: https://datasheet.ciiva.com/25651/ap7361-25651049.pdf?src-supplier=Digi-Key; ComponentLink2Description: https://datasheet.ciiva.com/25651/ap7361-25651049.pdf?src-supplier=Digi-Key; ComponentLink3URL: https://datasheet.ciiva.com/29568/ap7361-29568378.pdf?src-supplier=Digi-Key; ComponentLink3Description: https://datasheet.ciiva.com/29568/ap7361-29568378.pdf?src-supplier=Digi-Key; ComponentLink4URL: https://datasheet.ciiva.com/29568/ap7361-29568379.pdf?src-supplier=Digi-Key; ComponentLink4Description: https://datasheet.ciiva.com/29568/ap7361-29568379.pdf?src-supplier=Digi-Key; Supplier Part Number 1: AP7361-33E-13DICT-ND
U3 = STM32F103C8T6: IC MCU 32BIT 64KB FLASH 48LQFP; Manufacturer: STMicroelectronics; RAM Size: 20KB; Frequency: 72MHz; Max Power Dissipation: 363mW; Interface: I2C,SPI,USB,CAN,USART; Number of I/Os: 37; Number of Timers/Counters: 3; Max Supply Voltage: 3.6V; Number of ADC Channels: 10; Min Supply Voltage: 2V; Oscillator Type: Internal; Number of Programmable I/O: 48; Data Bus Width: 32b; Number of Bits: 32; Watchdog Timer: Yes; Peripherals: POR,PWM,WDT,DMA,Temp Sensor,I2C; Core Architecture: ARM; Number of PWM Channels: 1; Number of SPI Channels: 2; Supplier 1: Newark; Manufacturer Part Number: STM32F103C8T6; RoHS: Yes; Category: Microcontrollers; Pricing 1: 1=9,30000, 10=8,35000, 25=7,90000, 50=7,37000, 100=6,84000, 250=6,49000 (USD); Case/Package: LQFP; Number of Pins: 48; Weight: 0.006349oz; Min Operating Temperature: -40°C; Max Operating Temperature: 85°C; Packaging: Tray; Package Quantity: 1500; Density: 64KB; Memory Type: FLASH; Max Frequency: 72MHz; Memory Size: 64KB; Series: STM32F103C8; Termination: SMD/SMT; Number of I2C Channels: 2; Address Bus Width: 32b; Length: 7mm; Width: 7mm; Height: 1.4mm; Radiation Hardening: No; Lead Free: Lead Free; REACH SVHC: No SVHC; RoHS Compliant: Yes; ComponentLink1URL: https://datasheet.ciiva.com/15122/getdatasheetpartid-69880-15122076.pdf?src-supplier=Verical; ComponentLink1Description: https://datasheet.ciiva.com/15122/getdatasheetpartid-69880-15122076.pdf?src-supplier=Verical; ComponentLink2URL: https://datasheet.ciiva.com/8054/1730126-8054942.pdf?src-supplier=Element14; ComponentLink2Description: https://datasheet.ciiva.com/8054/1730126-8054942.pdf?src-supplier=Element14; ComponentLink3URL: https://datasheet.ciiva.com/14100/pustm-arm-microcont-stm32f103-en-14100508.pdf?src-supplier=Distrelec; ComponentLink3Description: https://datasheet.ciiva.com/14100/pustm-arm-microcont-stm32f103-en-14100508.pdf?src-supplier=Distrelec; ComponentLink4URL: https://datasheet.ciiva.com/16210/cd00161566-16210248.pdf?src-supplier=Future+Electronics; ComponentLink4Description: https://datasheet.ciiva.com/16210/cd00161566-16210248.pdf?src-supplier=Future+Electronics; ComponentLink5URL: https://datasheet.ciiva.com/48687/001075658-da-01-en-mcu-64kb-mem-stm32f103c8t6-lqfp-48-stm-48687589.pdf?src-supplier=Conrad; ComponentLink5Description: https://datasheet.ciiva.com/48687/001075658-da-01-en-mcu-64kb-mem-stm32f103c8t6-lqfp-48-stm-48687589.pdf?src-supplier=Conrad; Supplier Part Number 1: 59M2182
Y1 = CRYSTAL 8MHZ: Crystal 8MHz ±20ppm (Tol) ±30ppm (Stability) 12pF FUND 400Ohm 4-Pin Mini-CSMD T/R; Manufacturer: ECS International; Manufacturer Part Number: ECS-80-12-33-JGN-TR; Supplier 1: Digi-Key; RoHS: Yes; Stock 1: 338434; Pricing 1: 1=0,66000, 10=0,58100, 50=0,54280, 100=0,47980, 500=0,45450 (USD); Supplier Part Number 1: 50-ECS-80-12-33-JGN-CT-ND